# Altium schematic sheet schematics.SchDoc
size A2
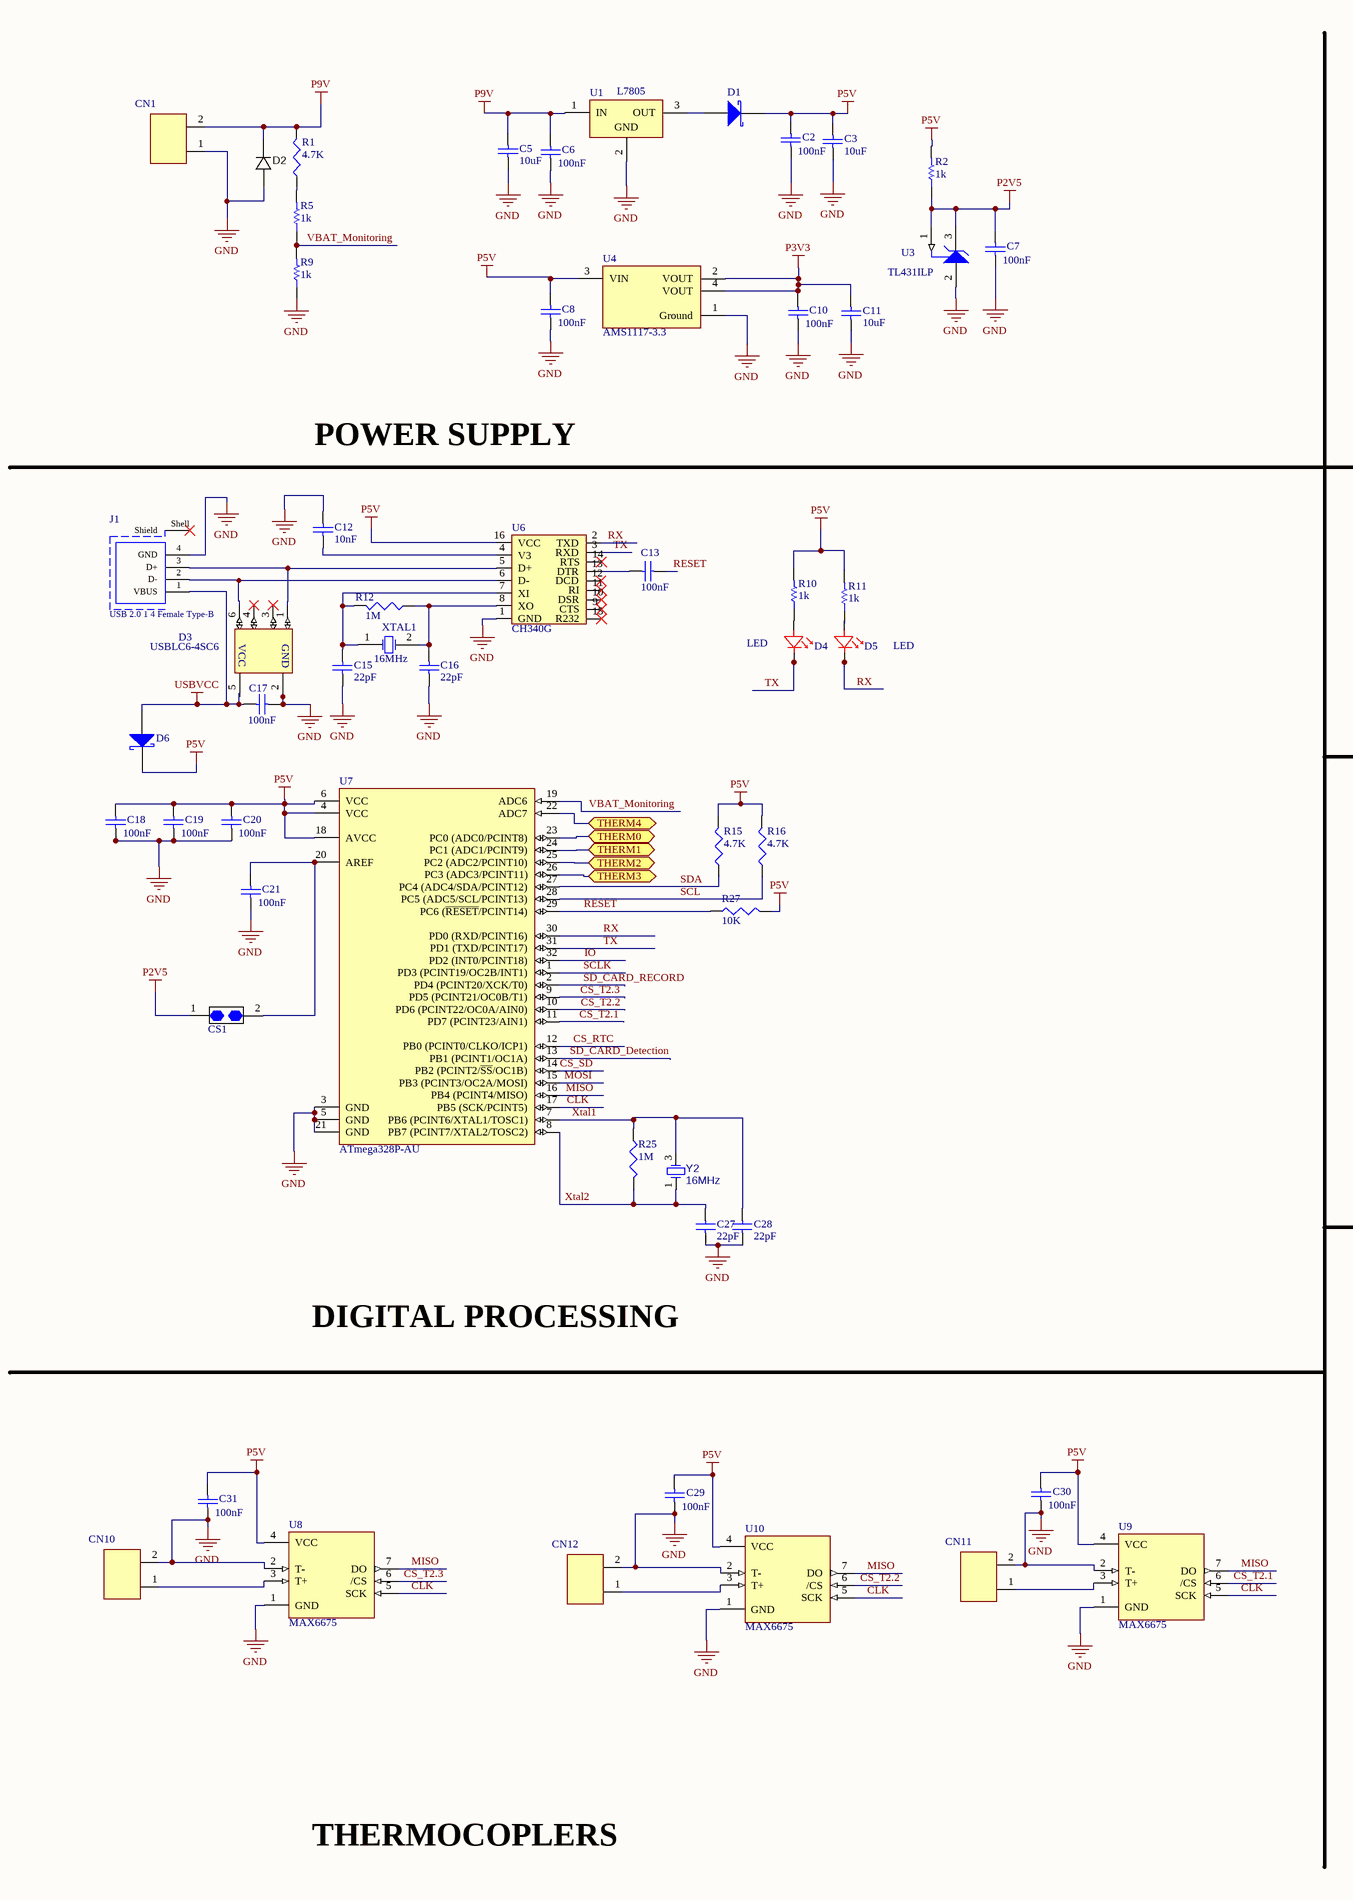
[diagram p0: schematics.SchDoc, left]
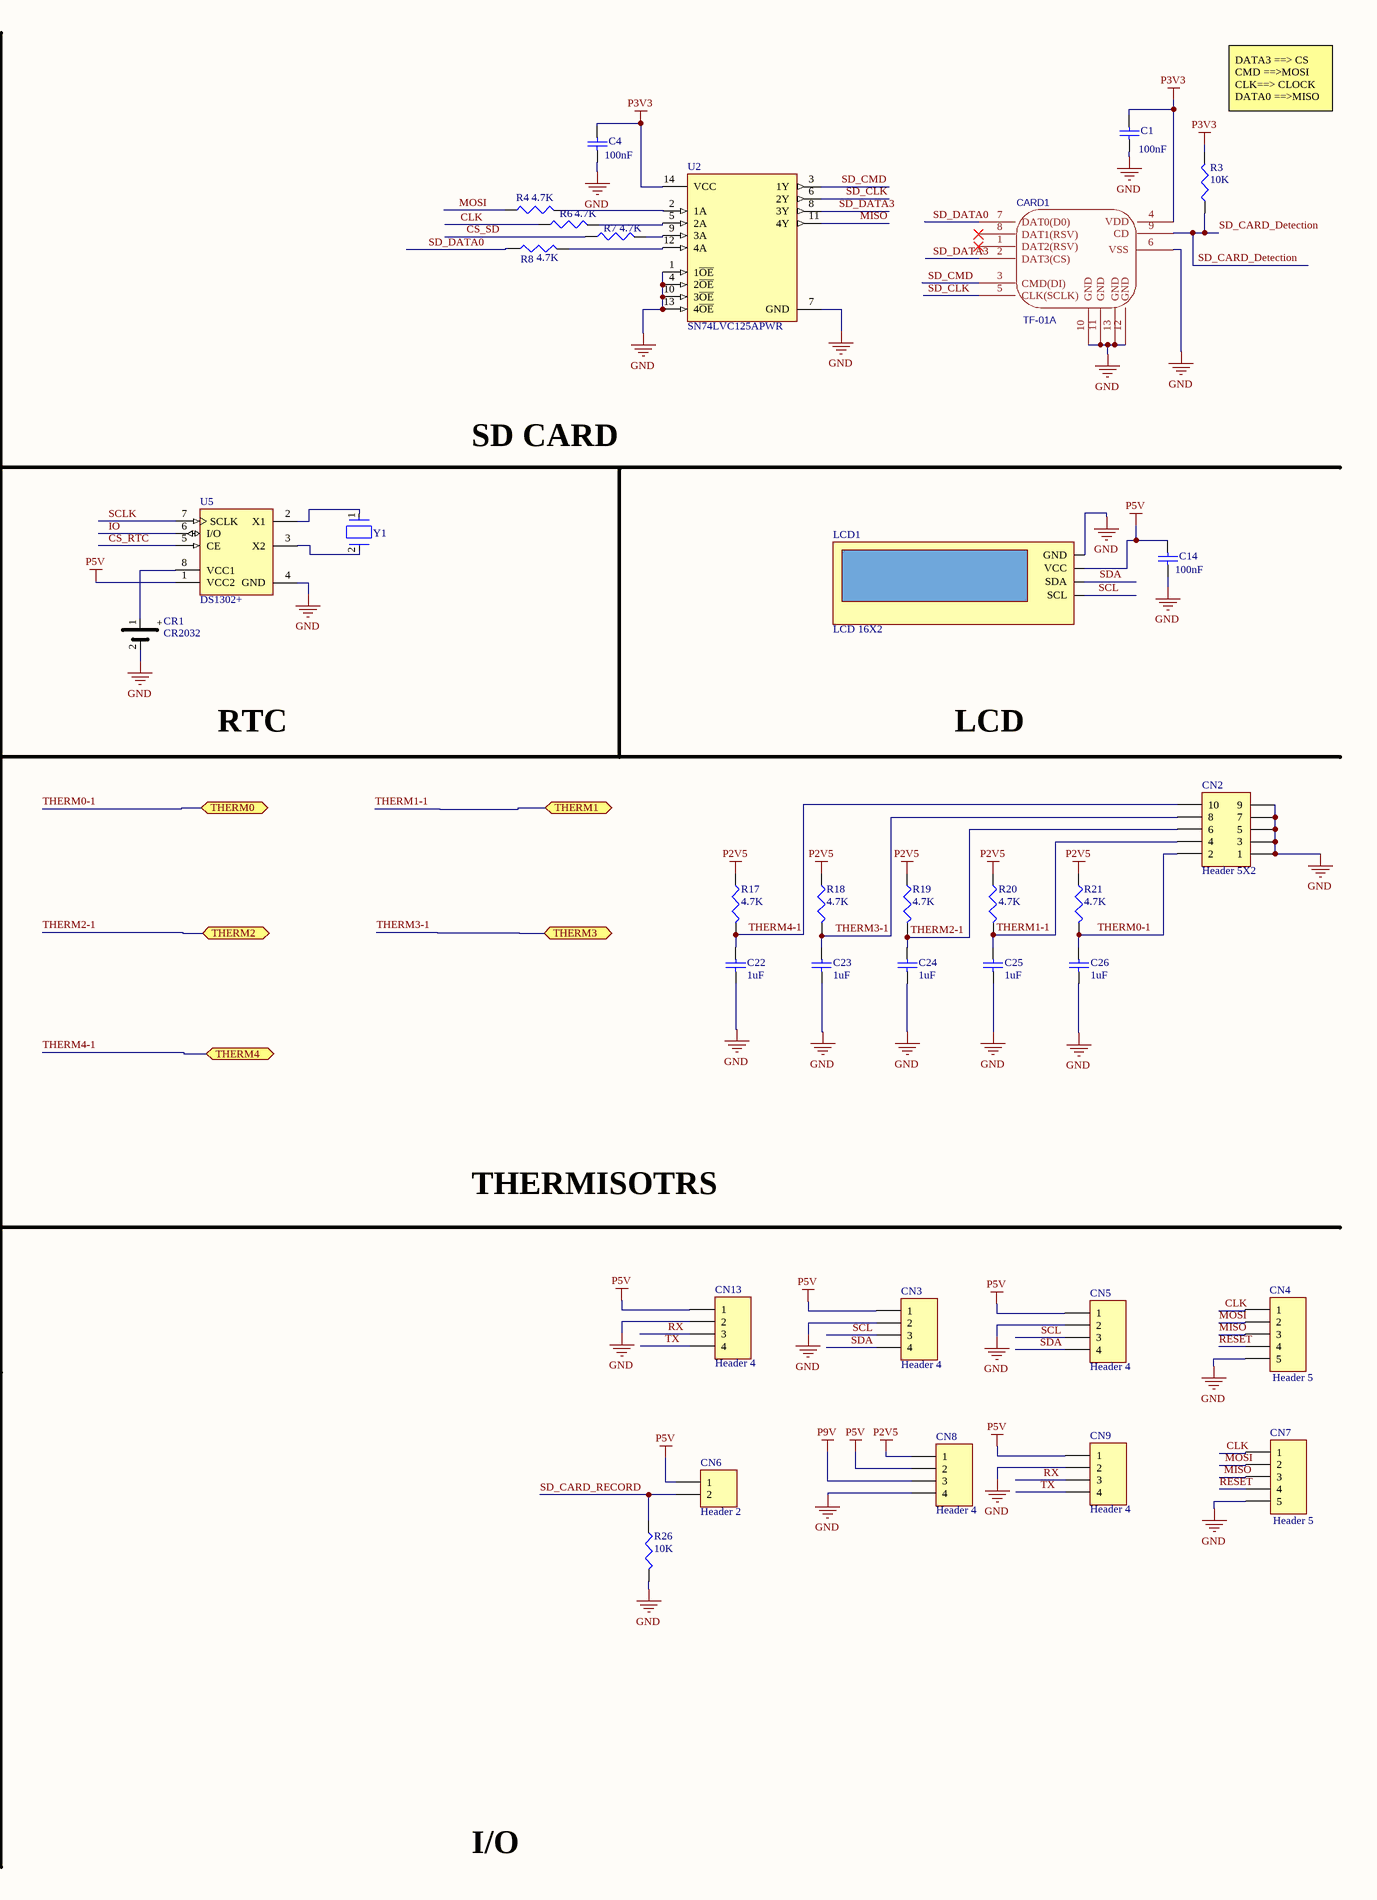
[diagram p1: schematics.SchDoc, right]

## Parts
C1  100nF  [Cap 1608-0603]
C2  100nF  [Cap 1608-0603]
C3  value 10uF  [CAP 3225-1210]  (hidden comment: Capacitor)
C4  100nF  [Cap 1608-0603]
C5  value 10uF  [CAP 3225-1210]  (hidden comment: Capacitor)
C6  100nF  [Cap 1608-0603]
C7  100nF  [Cap 1608-0603]
C8  100nF  [Cap 1608-0603]
C10  100nF  [Cap 1608-0603]
C11  value 10uF  [CAP 3225-1210]  (hidden comment: Capacitor)
C12  10nF  [Cap 1608-0603]
C13  100nF  [Cap 1608-0603]
C14  100nF  [Cap 1608-0603]
C15  value 22pF  [Cap 1608-0603]  (hidden comment: Capacitor)
C16  value 22pF  [Cap 1608-0603]  (hidden comment: Capacitor)
C17  100nF  [Cap 1608-0603]
C18  100nF  [Cap 1608-0603]
C19  100nF  [Cap 1608-0603]
C20  100nF  [Cap 1608-0603]
C21  100nF  [Cap 1608-0603]
C22  value 1uF  [Cap 1608-0603]  (hidden comment: Capacitor)
C23  value 1uF  [Cap 1608-0603]  (hidden comment: Capacitor)
C24  value 1uF  [Cap 1608-0603]  (hidden comment: Capacitor)
C25  value 1uF  [Cap 1608-0603]  (hidden comment: Capacitor)
C26  value 1uF  [Cap 1608-0603]  (hidden comment: Capacitor)
C27  value 22pF  [Cap 1608-0603]  (hidden comment: Capacitor)
C28  value 22pF  [Cap 1608-0603]  (hidden comment: Capacitor)
C29  100nF  [Cap 1608-0603]
C30  100nF  [Cap 1608-0603]
C31  100nF  [Cap 1608-0603]
CARD1  TF-01A  [TF-SMD_TF-01A2]
CN1  (no value)  [TERM2 3.5mm]
CN2  Header 5X2  [HDR2X5]
CN3  Header 4  [HDR1X4-HEADER]
CN4  Header 5  [HDR1X5-HEADER]
CN5  Header 4  [HDR1X4-HEADER]
CN6  Header 2  [HDR1X2-HEADER]
CN7  Header 5  [HDR1X5-HEADER]
CN8  Header 4  [HDR1X4-HEADER]
CN9  Header 4  [HDR1X4-HEADER]
CN10  (no value)  [TERM2 3.5mm]
CN11  (no value)  [TERM2 3.5mm]
CN12  (no value)  [TERM2 3.5mm]
CN13  Header 4  [HDR1X4-HEADER]
CR1  CR2032  [CR2032 holder]
CS1  CHEVRON  [CHEV]  (value not drawn)
D1  (no value)  [DIOM2616X08N]
D2  DIODE  [DO-214AC]  (value not drawn)
D3  USBLC6-4SC6  [FP-SOT23-6L-IPC_B]
D4  LED  [LED_0603R]
D5  LED  [LED_0603R]
D6  (no value)  [DIOM2616X08N]
J1  USB 2.0 1 4 Female Type-B  [61400416121]
LCD1  LCD 16X2  [LCD16X2]
R1  value 4.7K  [RES 1608-0603]  (hidden comment: Resistor 4.7K)
R2  1k  [RES 1608-0603]
R3  value 10K  [RES 1608-0603]  (hidden comment: Resistor 10k)
R4  value 4.7K  [RES 1608-0603]  (hidden comment: Resistor 4.7K)
R5  1k  [RES 1608-0603]
R6  value 4.7K  [RES 1608-0603]  (hidden comment: Resistor 4.7K)
R7  value 4.7K  [RES 1608-0603]  (hidden comment: Resistor 4.7K)
R8  value 4.7K  [RES 1608-0603]  (hidden comment: Resistor 4.7K)
R9  1k  [RES 1608-0603]
R10  1k  [RES 1608-0603]
R11  1k  [RES 1608-0603]
R12  value 1M  [RES 1608-0603]  (hidden comment: resistor)
R15  value 4.7K  [RES 1608-0603]  (hidden comment: Resistor 4.7K)
R16  value 4.7K  [RES 1608-0603]  (hidden comment: Resistor 4.7K)
R17  value 4.7K  [RES 1608-0603]  (hidden comment: Resistor 4.7K)
R18  value 4.7K  [RES 1608-0603]  (hidden comment: Resistor 4.7K)
R19  value 4.7K  [RES 1608-0603]  (hidden comment: Resistor 4.7K)
R20  value 4.7K  [RES 1608-0603]  (hidden comment: Resistor 4.7K)
R21  value 4.7K  [RES 1608-0603]  (hidden comment: Resistor 4.7K)
R25  value 1M  [RES 1608-0603]  (hidden comment: resistor)
R26  value 10K  [RES 1608-0603]  (hidden comment: resistor)
R27  value 10K  [RES 1608-0603]  (hidden comment: resistor)
U1  L7805  [TO220]
U2  SN74LVC125APWR  [FP-PW0014A-IPC_B]
U3  TL431ILP  [LP0003A]
U4  AMS1117-3.3  [FP-AMS1117-IPC_A]
U5  DS1302+  [P8+2]
U6  CH340G  [ch340g]
U7  ATmega328P-AU  [32A_N]
U8  MAX6675  [SOIC08]
U9  MAX6675  [SOIC08]
U10  MAX6675  [SOIC08]
XTAL1  16MHz  [HC-49 Crystal]
Y1  AB26TRB-32.768KHZ-T  [FP-AB26TRB-MFG]  (value not drawn)
Y2  16MHz  [3525 SMD Crystal]

## Ports
THERM0 (bidir), THERM1 (bidir), THERM2 (bidir), THERM3 (bidir), THERM4 (bidir)

## Nets
GND: C1.2 C2.1 C3.1 C4.1 C5.1 C6.1 C7.1 C8.1 C10.1 C11.1 C12.2 C14.1 C15.2 C16.2 C17.1 C18.1 C19.1 C20.1 C21.1 C22.2 C23.2 C24.2 C25.2 C26.2 C27.1 C28.1 C29.1 C30.1 C31.1 CARD1.6(VSS) CARD1.10(GND) CARD1.11(GND) CARD1.12(GND) CARD1.13(GND) CN1.1 CN2.1 CN2.3 CN2.5 CN2.7 CN2.9 CN3.2 CN4.5 CN5.2 CN7.5 CN8.4 CN9.2 CN10.2 CN11.2 CN12.2 CN13.2 CR1.2 D2.A D3.2(GND) J1.4(GND) LCD1.1(GND) R9.1 R26.1 U1.2(GND) U2.1(1~{OE}) U2.4(2~{OE}) U2.7(GND) U2.10(3~{OE}) U2.13(4~{OE}) U3.2(ANODE) U4.1(Ground) U5.4(GND) U6.1(GND) U7.3(GND) U7.5(GND) U7.21(GND) U8.1(GND) U8.2(T-) U9.1(GND) U9.2(T-) U10.1(GND) U10.2(T-)
P2V5: C7.2 CN8.1 CS1.1 R2.1 R17.1 R18.1 R19.1 R20.1 R21.1 U3.1(REF) U3.3(CATHODE)
P3V3: C1.1 C4.2 C10.2 C11.2 CARD1.4(VDD) R3.2 U2.14(VCC) U4.2(VOUT) U4.4(VOUT)
P5V: C2.2 C3.2 C8.2 C14.2 C18.2 C19.2 C20.2 C29.2 C30.2 C31.2 CN3.1 CN5.1 CN6.1 CN8.2 CN9.1 CN13.1 D1.K D6.K LCD1.2(VCC) R2.2 R10.2 R11.2 R15.2 R16.2 R27.1 U4.3(VIN) U5.1(VCC2) U6.16(VCC) U7.4(VCC) U7.6(VCC) U7.18(AVCC) U8.4(VCC) U9.4(VCC) U10.4(VCC)
P9V: C5.2 C6.2 CN1.2 CN8.3 D2.K R1.2 U1.1(IN)
USBVCC: C17.2 D6.A J1.1(VBUS)
CLK: CN4.1 CN7.1 R6.1 U7.17(PB5_(SCK/PCINT5)) U8.5(SCK) U9.5(SCK) U10.5(SCK)
CS_RTC: U5.5(CE) U7.12(PB0_(PCINT0/CLKO/ICP1))
CS_SD: R7.1 U7.14(PB2_(PCINT2/~{SS}/OC1B))
CS_T2.1: U7.11(PD7_(PCINT23/AIN1)) U9.6(/CS)
CS_T2.2: U7.10(PD6_(PCINT22/OC0A/AIN0)) U10.6(/CS)
CS_T2.3: U7.9(PD5_(PCINT21/OC0B/T1)) U8.6(/CS)
IO: U5.6(I/O) U7.32(PD2_(INT0/PCINT18))
MISO: CN4.3 CN7.3 U2.11(4Y) U7.16(PB4_(PCINT4/MISO)) U8.7(DO) U9.7(DO) U10.7(DO)
MOSI: CN4.2 CN7.2 R4.1 U7.15(PB3_(PCINT3/OC2A/MOSI))
RESET: C13.2 CN4.4 CN7.4 R27.2 U7.29(PC6_(~{RESET}/PCINT14))
RX: CN9.3 CN13.3 D5.2 U6.2(TXD) U7.30(PD0_(RXD/PCINT16))
SCL: CN3.3 CN5.3 LCD1.4(SCL) R16.1 U7.28(PC5_(ADC5/SCL/PCINT13))
SCLK: U5.7(SCLK) U7.1(PD3_(PCINT19/OC2B/INT1))
SD_CARD_Detection: CARD1.9(CD) R3.1 U7.13(PB1_(PCINT1/OC1A))
SD_CARD_RECORD: CN6.2 R26.2 U7.2(PD4_(PCINT20/XCK/T0))
SD_CLK: CARD1.5(CLK(SCLK)) U2.6(2Y)
SD_CMD: CARD1.3(CMD(DI)) U2.3(1Y)
SD_DATA0: CARD1.7(DAT0(D0)) R8.1
SD_DATA3: CARD1.2(DAT3(CS)) U2.8(3Y)
SDA: CN3.4 CN5.4 LCD1.3(SDA) R15.1 U7.27(PC4_(ADC4/SDA/PCINT12))
THERM0-1: C26.1 CN2.2 R21.2 U7.23(PC0_(ADC0/PCINT8)) ; port THERM0
THERM1-1: C25.1 CN2.4 R20.2 U7.24(PC1_(ADC1/PCINT9)) ; port THERM1
THERM2-1: C24.1 CN2.6 R19.2 U7.25(PC2_(ADC2/PCINT10)) ; port THERM2
THERM3-1: C23.1 CN2.8 R18.2 U7.26(PC3_(ADC3/PCINT11)) ; port THERM3
THERM4-1: C22.1 CN2.10 R17.2 U7.22(ADC7) ; port THERM4
TX: CN9.4 CN13.4 D4.2 U6.3(RXD) U7.31(PD1_(TXD/PCINT17))
VBAT_Monitoring: R5.1 R9.2 U7.19(ADC6)
Xtal1: C28.2 R25.2 U7.7(PB6_(PCINT6/XTAL1/TOSC1)) Y2.3(OSC2)
Xtal2: C27.2 R25.1 U7.8(PB7_(PCINT7/XTAL2/TOSC2)) Y2.1(OSC1)
NetC12_1: C12.1 U6.4(V3)
NetC13_1: C13.1 U6.13(DTR)
NetC15_1: C15.1 R12.2 U6.7(XI) XTAL1.1(OSC1)
NetC16_1: C16.1 R12.1 U6.8(XO) XTAL1.2(OSC2)
NetC21_2: C21.2 CS1.2 U7.20(AREF)
NetCN10_1: CN10.1 U8.3(T+)
NetCN11_1: CN11.1 U9.3(T+)
NetCN12_1: CN12.1 U10.3(T+)
NetCR1_1: CR1.1 U5.8(VCC1)
NetD1_A: D1.A U1.3(OUT)
NetD3_1: D3.1(I/O1) J1.3(D+) U6.5(D+)
NetD3_6: D3.6(I/O4) J1.2(D-) U6.6(D-)
NetD4_1: D4.1 R10.1
NetD5_1: D5.1 R11.1
NetR1_1: R1.1 R5.2
NetR4_2: R4.2 U2.2(1A)
NetR6_2: R6.2 U2.5(2A)
NetR7_2: R7.2 U2.9(3A)
NetR8_2: R8.2 U2.12(4A)
NetU5_2: U5.2(X1) Y1.1
NetU5_3: U5.3(X2) Y1.2

Not connected (* = marked no-connect by the designer): CARD1 1(DAT2(RSV))* 8(DAT1(RSV))*; D3 3(I/O2)* 4(I/O3)* 5(VBUS); J1 Shell(Shield)*; U6 9(CTS)* 10(DSR)* 11(RI)* 12(DCD)* 14(RTS)* 15(R232)*

## Notes on the sheet
- DATA3 ==> CS
  CMD ==>MOSI
  CLK==> CLOCK
  DATA0 ==>MISO
- POWER SUPPLY
- SD CARD
- RTC
- LCD
- THERMISOTRS
- DIGITAL PROCESSING
- THERMOCOPLERS
- I/O
- (in symbol CMP-2000-07370-2) VCC
- (in symbol CR2032) +

## Library data of the parts
C1 C2 C4 C6-C8 C10 C12-C14 C17-C21 C29-C31 = CapC-0603-100nF: CAP CER 0.1UF 50V X7R 0603/0805; Mfr.Ref: CT41G-0805-2X1-50V-0.1μF-M(N); Mfr: TORCH; Revision: July-2002: Re-released for DXP Platform.; Supplier.Ref: C138340; Supplier: LSCS; Manufacturer:: TORCH; Mfr. Part:: CT41G-0805-2X1-50V-0.1μF-M(N); Supplier:: LCSC; LCSC PART NUMBER: *; MANUF_REF: *
  C1 C2 C4 C6-C8 C10 C13 C14 C17-C21 C29-C31: Supplier.Part:: C83170
  C12: Supplier.Part:: C138340
C3 C5 C11 = CapC-1210-4.7uF-50V: 50V 10uF X7R ±10% 1210 Multilayer Ceramic Capacitors MLCC - SMD/SMT ROHS /; Manufacturer:: Samwha Capacitor; Mfr. Part:: CS3225X7R106K500NRL; Note: Approved sub OK; Revision: July-2002: Re-released for DXP Platform.; Supplier Part Number 1: 399-6785-1-ND; Supplier:: LCSC; Supplier.Part:: C2918502
C15 C16 C27 C28 = CapC-0603-22pF: 50V 22pF C0G ±5% 0603 Multilayer Ceramic Capacitors MLCC - SMD/SMT ROHS; Manufacturer:: Samwha Capacitor; Mfr. Part:: CS1608C0G220J500NRB; Note: Approved sub OK; Published: 8-Jun-2000; Revision: July-2002: Re-released for DXP Platform.; Supplier 1: Digi-Key; Supplier Part Number 1: 478-6204-1-ND; Supplier:: LCSC; Supplier.Part:: C5177174; LCSC PART NUMBER: *; MANUF_REF: *
C22-C26 = CapC-0603-1uF 50V: 50V 1uF X7R ±10% 0805 Multilayer Ceramic Capacitors MLCC - SMD/SMT ROHS /; Manufacturer:: Samwha Capacitor; Mfr. Part:: CS2012X7R105K500NRE; Note: Approved sub OK; Voltage: 16V; Revision: July-2002: Re-released for DXP Platform.; Supplier 1: Digi-Key; Supplier Part Number 1: 587-1241-1-ND; Package: 0603; Tolerance: 10%; Type: X7R; Supplier:: LCSC; Supplier.Part:: C516002
CARD1 = TF-01A: LCSC Part # C91145 / Manufacturer Korean Hroparts Elec; BOM_Manufacturer: 韩国韩荣; BOM_Supplier: LCSC; BOM_Manufacturer Part: TF-01A; BOM_Supplier Part: C91145; BOM_JLCPCB Part Class: Extended Part; spicePre: C; spiceSymbolName: TF-01A; Manufacturer:: Korean Hroparts Elec; Mfr. Part:: TF-01A; Supplier:: LCSC; Supplier.Part:: C91145; LCSC PART NUMBER: *; MANUF_REF: *
CN1 CN10-CN12 = ScrewTerminal-3.5mm-2Way: TERM BLK 2POS SIDE ENT 3.5MM PCB; Manufacturer:: DIBO; Mfr. Part:: DB301V-3.5-2P-GN-S; Note: Approved sub OK; Supplier 1: Digi-Key; Supplier Part Number 1: 277-5719-ND; Supplier:: LCSC; Supplier.Part:: C695629; LCSC PART NUMBER: *; MANUF_REF: *
CN2 = Header 5X2: Header, 5-Pin, Dual row; Manufacturer 1: Generic Header; Manufacturer:: DEALON; Mfr. Part:: DZ254R-22-10-63; Note: Approved sub OK; Supplier:: LCSC; Supplier.Part:: C2935920
CN3 CN5 CN8 CN9 CN13 = Header 4: Header, 4-Pin; Manufacturer 1: Generic Header; Manufacturer:: XFCN; Mfr. Part:: PZ254V-11-04P; Note: Approved sub OK; LatestRevisionDate: 17-Jul-2002; LatestRevisionNote: Re-released for DXP Platform.; Supplier:: LCSC; Supplier.Part:: C2691448; LCSC PART NUMBER: *; MANUF_REF: *
CN4 CN7 = Header 5x1: Header, 5-Pin; Manufacturer 1: Generic Header; Manufacturer:: Ckmtw(Shenzhen Cankemeng); Mfr. Part:: B-2100S05P-A110; Note: Approved sub OK; LatestRevisionDate: 17-Jul-2002; LatestRevisionNote: Re-released for DXP Platform.; Supplier:: LCSC; Supplier.Part:: C124379; LCSC PART NUMBER: *; MANUF_REF: *
CN6 = Header 2: Header, 2-Pin; Manufacturer 1: Generic Header; Note: Approved sub OK; LatestRevisionDate: 17-Jul-2002; LatestRevisionNote: Re-released for DXP Platform.; Publisher: Altium Limited
CR1 = CR2032: CR2032 platique holder though hole; Mfr. Part:: BS-02-A1AJ006; Supplier:: LCSC; Supplier.Part:: C964745
D1 D6 = Diode Schottky 2A 40V: DIODE SCHOTTKY 40V 2A SOD123F / C5199107; Manufacturer:: HXY MOSFET; Mfr. Part:: K24; Note: Approved sub OK; Revision: July-2002: Re-released for DXP Platform.; Supplier 1: Digi-Key; Supplier Part Number 1: SS24FLCT-ND; Supplier:: LCSC; Supplier.Part:: C5199107; LCSC PART NUMBER: *; MANUF_REF: *
D2 = DIODE_100V_1.5A_SMA: 400V 1.15V@1.5A 4us 1.5A 1uA@400V DO-214AC(SMA) Avalanche Diodes ROHS; Manufacturer:: Vishay Intertech; Mfr. Part:: BYG10G-E3/TR; Ratings: 100V; 1.5A; Material: Si; Diode Type: Standard; Value: Vf = 1.15V @ 1.5A (Max); SCDType: source; Note: Approved sub OK; Package / Case: DO-214AC, SMA; Supplier 1: Digi-Key; Supplier Part Number 1: S2BA-FDICT-ND; Supplier:: LCSC; Supplier.Part:: C2999376
D3 = CMP-2000-07370-2: TVS DIODE 5.25V 17V SOT23-6 / SOT-23-6 ESD Protection Devices ROHS; Mfr: TECH PUBLIC; Supplier.Ref: C5197386; Supplier: LSCS; Mfr.Ref: USBLC6-4SC6; Manufacturer:: TECH PUBLIC; Mfr. Part:: USBLC6-4SC6; Supplier:: LCSC; Supplier.Part:: C5197386; LCSC PART NUMBER: *; MANUF_REF: *
D4 = Diode_LED: 20mA 639nm Colorless transparence -55℃~+85℃ 631nm~631nm Red 130° 75mW 0603 Light Emitting Diodes (LED) ROHS /; Mfr.Ref: LTST-C191KRKT; Mfr: LITEON; Manufacturer:: Lite-On; Supplier.Ref: C125099; Supplier: LCSC; Mfr. Part:: LTST-C191KRKT; Supplier:: LCSC; Supplier.Part:: C125099; LCSC PART NUMBER: *; MANUF_REF: *
D5 = Diode_LED: 20mA 639nm Colorless transparence -55℃~+85℃ 631nm~631nm Red 130° 75mW 0603 Light Emitting Diodes (LED) ROHS; Mfr.Ref: LTST-C191KRKT; Mfr: LITEON; Manufacturer:: Lite-On; Supplier.Ref: C125099; Supplier: LCSC; Mfr. Part:: LTST-C191KRKT; Supplier:: LCSC; Supplier.Part:: C125099; LCSC PART NUMBER: *; MANUF_REF: *
J1 = CMP-1502-03243-1: USB 2.0 1 4 Female Type-B Plugin USB Connectors ROHS; Mfr.Ref: 921-111A1010D10200; Mfr: Jing Extension of the Electronic Co.; Supplier.Ref: C46392; Supplier: LSCS; Manufacturer:: Jing Extension of the Electronic Co.; Mfr. Part:: 921-111A1010D10200; Supplier:: LCSC; Supplier.Part:: C46392; LCSC PART NUMBER: *; MANUF_REF: *
R1 R4 R6-R8 R15 R16 = Res-0603-4K7: RES SMD 4.7K OHM 1% 1/10W 0603; Manufacturer:: FH (Guangdong Fenghua Advanced Tech); Mfr. Part:: RS-05K472JT; Note: Approved sub OK; Published: 8-Jun-2000; Revision: July-2002: Re-released for DXP Platform.; Supplier 1: Digi-Key; Supplier Part Number 1: 311-4.70KHRCT-ND; Supplier:: LCSC; Supplier.Part:: C115310
R2 R5 R9-R11 = RES100K_0402_3: ±1% 1/16W Thin Film Resistor 50V ±25ppm/℃ -55℃~+155℃ 1kΩ 0603 Chip Resistor - Surface Mount ROHS; Mfr.Ref: MR08X271 JTL; Mfr: Walsin Tech Corp; Manufacturer:: YAGEO; Mfr. Part:: RC0805FR-071KL; Supplier.Ref: C2918548; Supplier: LCSC; Supplier:: LCSC; Supplier.Part:: C95781; LCSC PART NUMBER: *; MANUF_REF: *
R3 R26 R27 = Res-0603-10K: RES SMD 10K OHM 1% 1/10W 0603; Manufacturer:: UNI-ROYAL(Uniroyal Elec); Mfr. Part:: 0805W8F1002T5E; Note: Approved sub OK; Published: 8-Jun-2000; Revision: July-2002: Re-released for DXP Platform.; Supplier 1: Digi-Key; Supplier Part Number 1: 311-10.0KHRCT-ND; Supplier:: LCSC; Supplier.Part:: C17414; LCSC PART NUMBER: *; MANUF_REF: *
R12 R25 = Res-0603-1M: RES SMD 1M OHM 1% 1/10W 0603; Manufacturer:: UNI-ROYAL(Uniroyal Elec); Mfr. Part:: 0805W8F1004T5E; Note: Approved sub OK; Published: 8-Jun-2000; Revision: July-2002: Re-released for DXP Platform.; Supplier 1: Digi-Key; Supplier Part Number 1: 311-1.00MHRDKR-ND; Supplier:: LCSC; Supplier.Part:: C17514; LCSC PART NUMBER: *; MANUF_REF: *
R17-R21 = Res-0603-4K7: 125mW Thick Film Resistors ±1% 4.7kΩ 0805 Chip Resistor - Surface Mount ROHS /; Manufacturer:: FH (Guangdong Fenghua Advanced Tech); Mfr. Part:: 0805W8F4701T5E; Note: Approved sub OK; Published: 8-Jun-2000; Revision: July-2002: Re-released for DXP Platform.; Supplier 1: Digi-Key; Supplier Part Number 1: 311-4.70KHRCT-ND; Supplier:: LCSC; Supplier.Part:: C17673
U1 = CMP-0244-00483-1: Positive Voltage Regulator, 5V, 3-Pin TO-220; PackageDescription: TO, Thru-Hole, Vertical, Heatsink Mounted; 3 In-Line Leads; Pitch 2.54 mm; ComponentLink2Description: Datasheet; PackageReference: TO220; ComponentLink3URL: http://www.st.com/internet/com/TECHNICAL_RESOURCES/TECHNICAL_LITERATURE/PACKAGE_INFORMATION/CD00004649.pdf; DatasheetVersion: 16/11/2011; ComponentLink1Description: Manufacturer URL; ComponentLink1URL: http://www.st.com; PackageVersion: ver3.0; ComponentLink3Description: Package Specification; ComponentLink2URL: http://www.st.com/internet/com/TECHNICAL_RESOURCES/TECHNICAL_LITERATURE/DATASHEET/CD00000444.pdf; LCSC PART NUMBER: *; MANUF_REF: *
U2 = CMP-0440-00179-4: IC BUF NON-INVERT 3.6V 14TSSOP; Max Power Dissipation: 500mW; Number of Bits per Element: 1; Number of Bits: 4; Quiescent Current: 1uA; Min Supply Voltage: 1.65V; Propagation Delay: 4.6ns; High Level Output Current: -24mA; Logic Function: Buffer; Low Level Output Current: 24mA; Polarity: Non-Inverting; Turn-On Delay Time: 5.3ns; Number of Output Lines: 3; Mount: Surface Mount; Lead Free: Lead Free; Number of Outputs: 4; Max Supply Voltage: 3.6V; Packaging: Tape and Reel; Radiation Hardening: No; Number of Channels: 4; REACH SVHC: No SVHC; Length: 5mm; Number of Elements: 4; Contact Plating: Gold; Case/Package: TSSOP; Number of Input Lines: 4; Number of Inputs: 4; Height: 1.15mm; Number of Circuits: 4; Termination: SMD/SMT; Min Operating Temperature: -40°C; Package Quantity: 1; Number of Gates: 4; Max Operating Temperature: 125°C; Width: 4.4mm; Number of Pins: 14; LCSC PART NUMBER: *; MANUF_REF: *
U3 = CMP-0366-00043-2: Adjustable Precision Shunt Regulator, 34 ppm / degC, 100 mA, -40 to 85 degC, 3-pin TO-92 (LP), Pb-Free (RoHS); Manufacturer: Texas Instruments; Iout/Iz(Max)(mA): 100; Rating: Military; Temp Coeff(Typ)(ppm/ degree C): 34; Initial Accuracy @ 25/deg C(%): 2; SubFamily: Shunt Voltage Reference; VO Adj(Max)(V): 36; VO Adj(Min)(V): 2.495; Temp Coeff(Max)(ppm/ degree C): 92; Min Iz for Regulation(uA): 600; PackageReference: LP0003A; ComponentLink1URL: http://www.ti.com/; ComponentLink1Description: Manufacturer URL; Eco-Plan: Pb-Free (RoHS); ComponentLink3URL: http://www.ti.com/litv/pdf/msot002a; PartNumber: TL431ILP; DatasheetVersion: SLVS543M; ComponentLink2Description: Datasheet; Mounting Technology: Through Hole; ComponentLink3Description: Package Specification; PackageDescription: Plastic Cylindrical Package, Formed Lead Option (TO-92); ComponentLink2URL: http://www.ti.com/general/docs/lit/getliterature.tsp?genericPartNumber=TL431&fileType=pdf; Code_JEDEC: TO-226; PackageVersion: 4040001-2/C; LCSC PART NUMBER: *; MANUF_REF: *
U4 = CMP-209535-000001-1: LDO Voltage Regulators 1A, 3.3V / C347222; Manufacturer: Advanced Monolithic Systems; Manufacturer:: UMW(Youtai Semiconductor Co., Ltd.); Dropout Voltage: 1.1V; Output Type: Fixed; Nominal Supply Current: 5mA; Max Power Dissipation: 1.2W; Max Supply Voltage: 15V; Number Of Outputs: 1; Standoff Height: 0.64mm; Max Junction Temp: +125°C; Height: 1.8mm; Package: AMS1117; Device Class L2: Power Management ICs; ComponentLink2Description: Datasheet; ComponentLink2URL: http://www.advanced-monolithic.com/pdf/ds1117.pdf; Category: IC; RoHS: TRUE; Automotive: No; Device Class L1: Integrated Circuits (ICs); Output Current: 1A; Device Class L3: Voltage Regulators - Linear; Temperature: -40°C to +125°C; Output Voltage: 3.3V; Manufacturer Part Number: AMS1117-3.3; Temperature Range Low: -40°C; Octopart: https://octopart.com/ams1117-3.3-advanced+monolithic+systems-25899300; Lead Free: Yes; Ipc Land Pattern Name: SOT229P700X180-4; Temperature Range High: +125°C; Mfr. Part:: AMS1117-3.3; Supplier:: LCSC; Supplier.Part:: C347222; LCSC PART NUMBER:: C347222; MANUF_REF:: AMS1117-3.3
U5 = CMP-0254-00144-1: Trickle-Charge Timekeeping Chip, 8-Pin PDIP, 0 to 70 degC, Pb-Free; ComponentLink3URL: http://pdfserv.maxim-ic.com/package_dwgs/21-0043.PDF; PackageVersion: revE, 2011; ComponentLink1Description: Manufacturer URL; Code_JEDEC: MS-001-AB; ComponentLink1URL: http://www.maxim-ic.com; PackageDescription: 8-Pin Plastic Dual-In-Line, Narrow (0.3in), Pitch 2.54 mm, PDIP(N), Pb-Free; ComponentLink2Description: Datasheet; ComponentLink2URL: http://datasheets.maxim-ic.com/en/ds/DS1302.pdf; PackageReference: P8+2; DatasheetVersion: 12-Feb-2008; ComponentLink3Description: Package Specification
U6 = CH340G: 2Mbps Transceiver USB 2.0 SOP-16 USB ICs ROHS; LCSC PART NUMBER: *; MANUF_REF: *
U7 = CMP-0095-00269-2: 8-bit AVR Microcontroller, 32KB Flash, 1KB EEPROM, 2KB SRAM, 32-pin TQFP, Industrial Grade (-40°C to 85°C); PackageDescription: 32-Lead, 7x7x1.0 mm Body, 0.8mm Lead Pitch, Thin Profile Plastic Quad Flat Package (TQFP); DatasheetVersion: revD, May-2011; RevisionNote: DatasheetVersion & PackageVersion updated. URLs added.; ComponentLink1URL: http://www.atmel.com/; ComponentLink2Description: ATmega48A/48PA/88A/88PA/168A/168PA/328/328P Datasheet; Code_JEDEC: MS-026-ABA; ComponentLink1Description: Manufacturer URL; PackageReference: 32A; ComponentLink3Description: ATmega48A/48PA/88A/88PA/168A/168PA/328/328P Summary; ComponentLink2URL: http://www.atmel.com/dyn/resources/prod_documents/doc8271.pdf; PackageVersion: revC, Oct-2010; ComponentLink3URL: http://www.atmel.com/dyn/resources/prod_documents/8271S.pdf; LCSC PART NUMBER: *; MANUF_REF: *
U8-U10 = MAX6675: Mfr. Part:: MAX6675ISA+T; Supplier.Part:: C16030; Supplier:: LCSC
XTAL1 = Xtal HC_49S: HC-49 Crystal; LCSC PART NUMBER: *; MANUF_REF: *
Y1 = CMP-27762-006068-1: CRYSTAL 32.7680KHZ 12.5PF TH; Frequency Stability: -0.034ppm; Frequency Tolerance: 20ppm; Series Resistance: 50kR; Case/Package: Radial; Package Quantity: 500; Packaging: Tape and Reel; Lead Pitch: 2.54mm; Termination: Radial; Mount: Surface Mount; Frequency: 32.768kHz; Min Operating Temperature: -40°C; REACH SVHC: No SVHC; Load Capacitance: 12.5pF; Lead Free: Lead Free; Operating Frequency: 32.768 kHz; Max Operating Temperature: 85°C; Length: 6mm; Height: 0.075inch; Depth: 1.9mm; Tolerance: 20ppm; ESR (Equivalent Series Resistance): 50kR; Number of Pins: 2; Series: AB26TRB
Y2 = XTAL_2: CRYSTAL 16.0000MHZ 18PF SMD; Manufacturer:: TAE(Zhejiang Abel Elec); Mfr. Part:: TXM16M0004322KBCDO00T; Note: Approved sub OK; Supplier 1: Digi-Key; Supplier Part Number 1: SER3686CT-ND; Supplier:: LCSC; Supplier.Part:: C362471; LCSC PART NUMBER: *; MANUF_REF: *
CS1 = CHEVRON: LCSC PART NUMBER: *; MANUF_REF: *